# Altium schematic sheet 3v3_power.SchDoc: 3v3 Power Source
size A4; DocumentNumber: 3; SheetNumber: 3; SheetTotal: 6
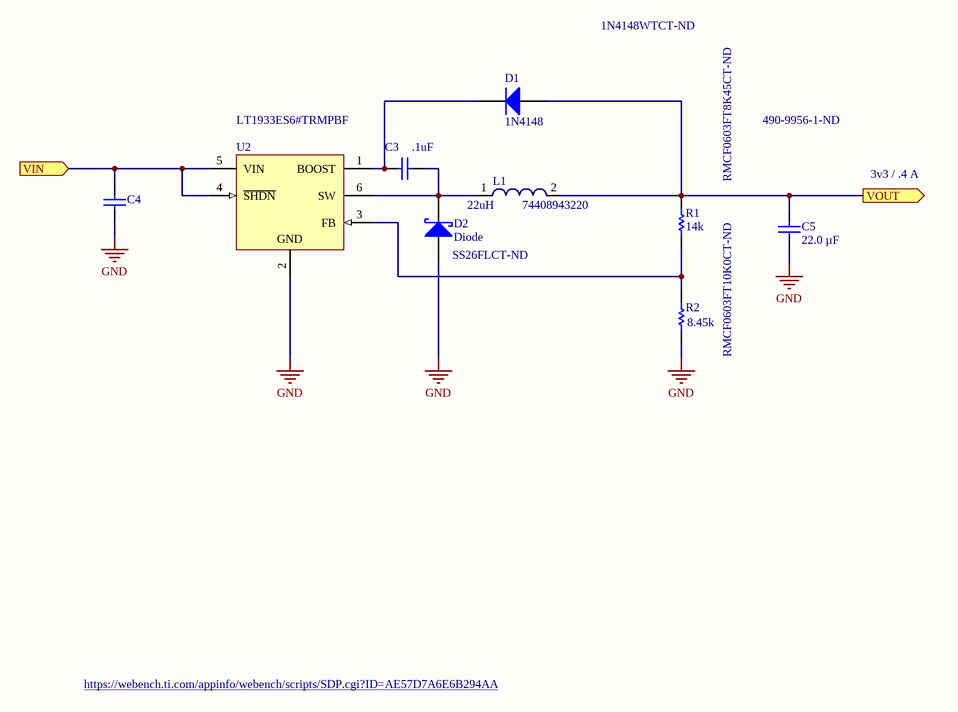
[diagram p0: 3v3_power.SchDoc]

## Parts
C3  Capacitance: .1uF  [CAPC2013X135X45LL10T25]  (hidden comment: Murata GRM21BR71H104KA01L)
C4  Murata GRM21BC8YA225KA73L  [CAPC2013X140X45ML15T25]  (value not drawn)
C5  Capacitance: 22.0 µF  [PCB-zk3e6ylmsz65xxlgquxh-1]  (hidden comment: SYM-de6015a2879501a7-1)
D1  1N4148  [PCB-1N4148W-7-F]
D2  Diode  [PCB-5gde02dk4bufsuch8kid-1]
L1  74408943220  Inductance: 22uH  [WE-SPC 4838]
R1  Resistance: 14k  [PCB-9ahxsq8gddjqcnfjmojj-1]  (hidden comment: Stackpole Electronics RMCF0603FT8K45)
R2  Resistance: 8.45k  [PCB-9ahxsq8gddjqcnfjmojj-1]  (hidden comment: Stackpole Electronics RMCF0603FT14K0)
U2  LT1933ES6#TRMPBF  [LT-S6-6-SOT-23_L]

## Ports
VIN (in), VOUT (out)

## Nets
GND: C4.2 C5.1 D2.1(A) R2.1 U2.2(GND)
VIN: C4.1 U2.4(~{SHDN}) U2.5(VIN) ; port VIN
VOUT: C5.2 D1.1(A) L1.2 R1.1 ; port VOUT
NetC3_1: C3.1 D1.2(K) U2.1(BOOST)
NetC3_2: C3.2 D2.2(K) L1.1 U2.6(SW)
NetR1_2: R1.2 R2.2 U2.3(FB)

## Notes on the sheet
- 1N4148WTCT-ND
- 490-9956-1-ND
- RMCF0603FT8K45CT-ND
- 3v3 / .4 A
- (near D2) SS26FLCT-ND
- RMCF0603FT10K0CT-ND
- https://webench.ti.com/appinfo/webench/scripts/SDP.cgi?ID=AE57D7A6E6B294AA
- Title
- Size:
- Date:
- A4
- Engineer:
- Time:
- Sheet
- Revision:
- of
- File:

## Library data of the parts
C3 = CMP-db42124a01380485-1: Capacitor 10% GRM21BR71H104KA01/GRM21BR71H104KA01L MURATA RoHS Micro Farad=0.1 V=50 SO0805; Size-Length: 2.00 mm; Manufacturer Part Number: GRM21BR71H104KA01L
C4 = CMP-3979846-2: MURATA   GRM21BC8YA225KA73L   CAP, MLCC, X6S, 2.2UF, 35V, 0805; Capacitance Tolerance: ±10%; Case/Package (SI): 2012; Voltage Rating (DC): 35.0 V; Capacitance: 2.2uF; Dielectric Characteristic: X6S; Lifecycle Status: Active; Octopart Url: https://octopart.com/grm21bc8ya225ka73l-murata-20010139; OctopartID: 70ccb8f70131af0b; Packaging: Cut Tape (CT); REACH SVHC Compliance: No SVHC; RoHS: Compliant; Size-Length: 0.002 m; Size-Thickness: 0.00125 m; Size-Width: 0.00125 m
C5 = CMP-de6015a2879501a7-1: Cap Ceramic 22uF 16V X6S 20% SMD 0805 105°C Embossed T/R; Size-Width: 1.25 mm; Case/Package: 0805; Octopart URL: http://octopart.com/grm21bc81c226me44l-murata-46693523
D1 = CMP-791fb3587d52a6d8-18: Fast Switching Diode, 100V, 400mW, Surface Mount, SOD-123; Manufacturer PN: 1N4148W-7-F; Current Rating: 150 mA; Output Current: 300mA (max); Datasheet PDF: https://www.diodes.com/assets/Datasheets/ds30086.pdf; OctopartID: 791fb3587d52a6d8; Mounting Style: Surface Mount; Voltage Rating (DC): 100V; Octopart URL: https://octopart.com/1n4148w-7-f-diodes+inc.-55386411; Manufacturer Part Number: 1N4148W-7-F; Case/Package: SOD-123; RoHS: Compliant
D2 = CMP-0675ccf66d19d9b2-1: Diode Schottky Barrier Rectifier 60V 2A 2-Pin SOD-123F T/R; Mounting Style: Surface Mount; Digikey URL: http://www.digikey.com/product-detail/en/fairchild-on-semiconductor/SS26FL/SS26FLCT-ND/5305094; OctopartID: 0675ccf66d19d9b2
L1 = CMP-915955-2: SMD Shielded Power Inductor WE-SPC, L=22 µH; Self Resonant Frequency: 19000000.0 Hz; Octopart Url: https://octopart.com/74408943220-w%C3%BCrth+elektronik-22866607; OctopartID: 1e41d617d188c186; Packaging: Cut Tape (CT); REACH SVHC Compliance: No SVHC; RoHS: Compliant
R1 = CMP-89084127803b56cf-1: Res Thick Film 0603 8.45K Ohm 1% 0.1W(1/10W) }100ppm/ Molded SMD Automotive T/R; Lead-Free Status: Lead Free; Power Rating: 100 mW; Octopart URL: https://octopart.com/rmcf0603ft8k45-stackpole+electronics-19213397; Manufacturer Part Number: RMCF0603FT8K45; Case/Package: 0603; Mounting Style: Surface Mount; Packaging: Tape & Reel (TR); Resistance Tolerance: ±1%; RoHS: Compliant; OctopartID: 89084127803b56cf
R2 = CMP-c96e0141c6a016a9-1: Res Thick Film 0603 14K Ohm 1% 0.1W(1/10W) }100ppm/ Molded SMD Automotive T/R; Lead-Free Status: Lead Free; Power Rating: 100 mW; Octopart URL: https://octopart.com/rmcf0603ft14k0-stackpole+electronics-19212968; Manufacturer Part Number: RMCF0603FT14K0; Case/Package: 0603; Mounting Style: Surface Mount; Packaging: Tape & Reel (TR); Resistance Tolerance: ±1%; RoHS: Compliant; OctopartID: c96e0141c6a016a9
U2 = CMP-1482538-2: 600 mA, 500 kHz Step-Down Switching Regulator, 6-pin SOT23 (S6-6), -40 to 85 degC, Pb-Free, Mini Tape and Reel; Frequency: 500000.0 Hz; Lead-Free Status: Lead Free; Number of Outputs: 1; Output Current: 0.6 A; Output Voltage: 5.0 V; Topology: Buck; Mounting Style: Surface Mount; Number of Pins: 6; Octopart Url: https://octopart.com/lt1933es6%23trmpbf-linear+technology-533785; OctopartID: 3809f10b3876e7ce; Packaging: Tape & Reel (TR); REACH SVHC Compliance: No SVHC; RoHS: Compliant